# EAGLE design smart_ice_shield_pcb (EAGLE 9.6.2)
AUTHOR: Presley-Reyna-Roth; BOARD_NAME: IceyZap; DOC_NUM: 0; PROJECT_NAME: SmartIce; REVISION: 0
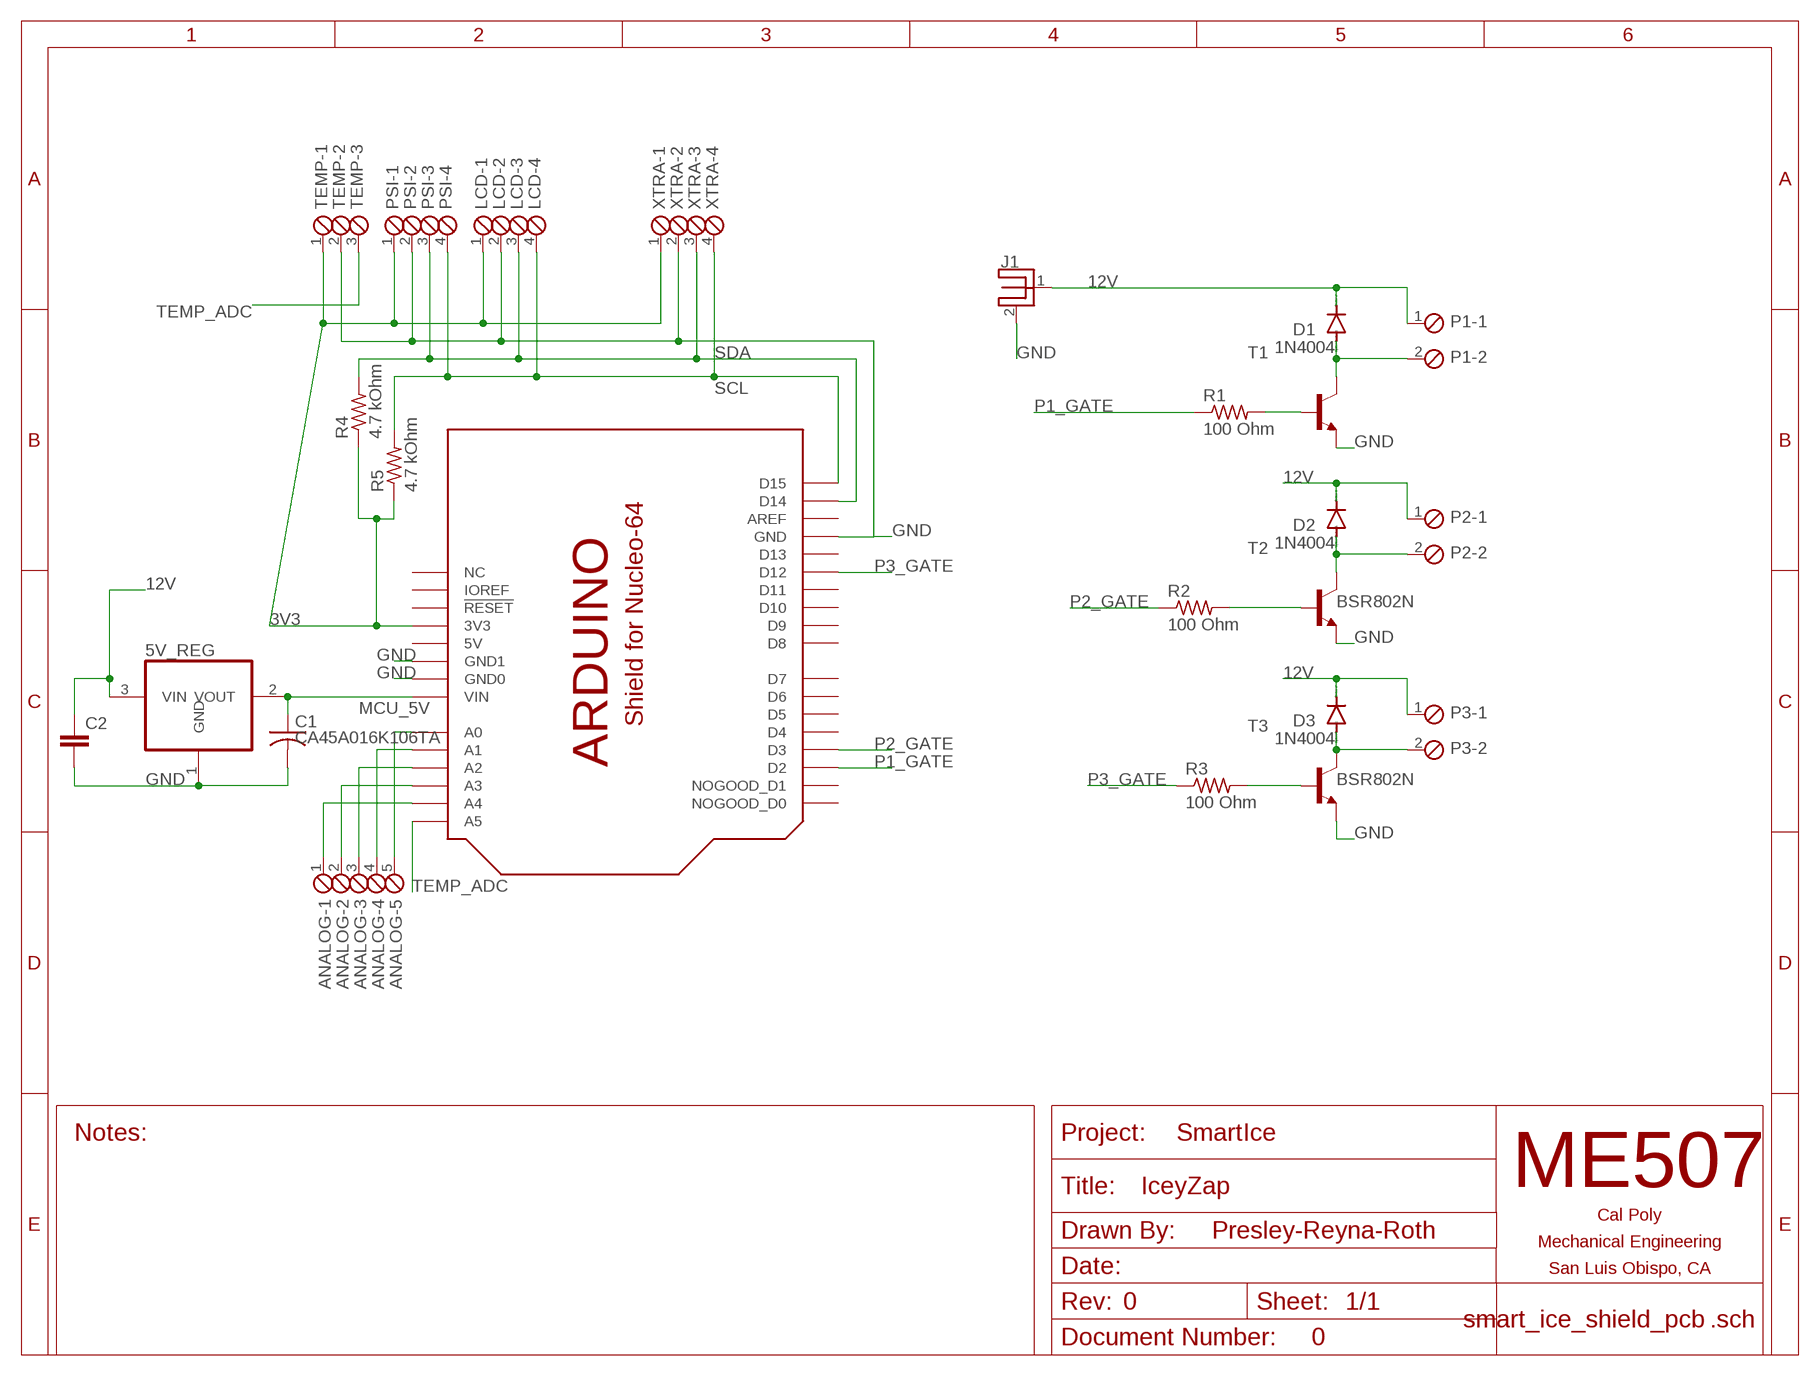
[diagram p0: schematic, sheet 1]

## Parts
5V_REG  LT1117CST  REG1117  [SOT223]
ANALOG  SCREWTERM_5P_254  [5POL254]
C1  CA45A016K106TA  C-USC1206  [C1206]
C2  C-EU025-025X050  [C025-025X050]
D1  1N4004  [DO41-10]
D2  1N4004  [DO41-10]
D3  1N4004  [DO41-10]
J1  BARREL5.5X2.1PJ-037A  [PJ-037A]
LCD  SCREWTERM_4P_254  [4POL254]
P1  SCREWTERM_2P_381  [2POL381]
P2  SCREWTERM_2P_381  [2POL381]
P3  SCREWTERM_2P_381  [2POL381]
PSI  SCREWTERM_4P_254  [4POL254]
R1  100 Ohm  R-US_R0805  [R0805]
R2  100 Ohm  R-US_R0805  [R0805]
R3  100 Ohm  R-US_R0805  [R0805]
R4  4.7 kOhm  R-US_R0805  [R0805]
R5  4.7 kOhm  R-US_R0805  [R0805]
T1  BSR802N  BSR13-NPN-SOT23-BEC  [SOT23-BEC]
T2  BSR802N  BSR13-NPN-SOT23-BEC  [SOT23-BEC]
T3  BSR802N  BSR13-NPN-SOT23-BEC  [SOT23-BEC]
TEMP  SCREWTERM_3P_254  [3POL254]
U$1  SHIELD_FOR_NUCLE0_64_SHORT  [SHIELD_FOR_NUCLEO_64_SHORT]
XTRA  SCREWTERM_4P_254  [4POL254]

## Nets
3V3: LCD.1 PSI.1 R4.1 R5.1 TEMP.1 U$1.3V(3V3) XTRA.1
12V: 5V_REG.3(VIN) C2.1 D1.C D2.C D3.C J1.1(CENTER) P1.1 P2.1 P3.1
GATE: R1.2 T1.B
GATE1: R2.2 T2.B
GATE2: R3.2 T3.B
GND: 5V_REG.1(GND) C1.2 C2.2 J1.2(BARREL) LCD.2 PSI.2 T1.E T2.E T3.E TEMP.2 U$1.GND U$1.GND1(GND0) U$1.GND2(GND1) XTRA.2
M-: D1.A P1.2 T1.C
M-1: D2.A P2.2 T2.C
M-2: D3.A P3.2 T3.C
MCU_5V: 5V_REG.2(VOUT) C1.1 U$1.VIN
N$1: ANALOG.5 U$1.A0
N$2: ANALOG.4 U$1.A1
N$3: ANALOG.3 U$1.A2
N$4: ANALOG.2 U$1.A3
N$5: ANALOG.1 U$1.A4
P1_GATE: R1.1 U$1.D2
P2_GATE: R2.1 U$1.D3
P3_GATE: R3.1 U$1.D12
SCL: LCD.4 PSI.4 R5.2 U$1.D15 XTRA.4
SDA: LCD.3 PSI.3 R4.2 U$1.D14 XTRA.3
TEMP_ADC: TEMP.3 U$1.A5
Unconnected: U$1.AREF U$1.D0(NOGOOD_D0) U$1.D1(NOGOOD_D1) U$1.D4 U$1.D5 U$1.D6 U$1.D7 U$1.D8 U$1.D9 U$1.D10 U$1.D11 U$1.D13 U$1.IOREF U$1.NC U$1.NRST(!RESET)

## Power pins joined to a net without a drawn wire
5V: U$1.5V

## Library data of the parts
5V_REG = burr-brown:REG1117: 800mA and 1A Low Dropout (LDO) Positive Regulator 1.8V, 2.5V, 2.85V, 3.3V, 5V, and Adj; MPN: REG1117; OC_FARNELL: 1097566; OC_NEWARK: 14P6981
ANALOG = ME507:SCREWTERM_5P: Screw Terminal Block This part is designed for a screw terminal connector. The 2.54mm (0.100 inch) foorprint can also be used for male or female pin headers such as those on most development boards. One can also solder wires directly into the holes, though this makes modifications or repairs to the system more inconvenient. Larger versions can carry more current.
C1 = rcl:C-US: CAPACITOR, American symbol; SPICEPREFIX: C
C2 = rcl:C-EU: CAPACITOR, European symbol; SPICEPREFIX: C
D1-D3 = diode:1N4004: DIODE general purpose rectifier, 1 A
J1 = LMLLC CONNECTORS:BARREL; MPN: PJ-037A
LCD PSI XTRA = ME507:SCREWTERM_4P: Screw Terminal Block This part is designed for a screw terminal connector. The 2.54mm (0.100 inch) foorprint can also be used for male or female pin headers such as those on most development boards. One can also solder wires directly into the holes, though this makes modifications or repairs to the system more inconvenient. Larger versions can carry more current.
P1-P3 = ME507:SCREWTERM_2P: Screw Terminal Block This part is designed for a screw terminal connector. The 2.54mm (0.100 inch) foorprint can also be used for male or female pin headers such as those on most development boards. One can also solder wires directly into the holes, though this makes modifications or repairs to the system more inconvenient. Larger versions can carry more current.
R1-R5 = rcl:R-US_: RESISTOR, American symbol; SPICEPREFIX: R
T1-T3 = transistor-neu-to92:*-NPN-: NPN Transistror
TEMP = ME507:SCREWTERM_3P: Screw Terminal Block This part is designed for a screw terminal connector. The 2.54mm (0.100 inch) foorprint can also be used for male or female pin headers such as those on most development boards. One can also solder wires directly into the holes, though this makes modifications or repairs to the system more inconvenient. Larger versions can carry more current.
U$1 = ME507:SHIELD_FOR_NUCLE0_64: Arduino Style Shield for Nucleo-64 This is a board outline with pin locations for an Arduino style shield which fits on top of an STM32 Nucleo-64. Pin names are generic except for Nucleo specific pins such as IOREF. There are two board sizes, the standard which matches the size of an Arduino Uno, and the short version which can be less expensive to produce if you don't need a lot of board area. The outline is on the DIMENSION layer. When making a new board, you must delete the lines which form the default board outline so that this package's outlines control the dimensions of the board. Pins D0 and D1 are connected to a communications port and are not available for general use, so they are labeled as NOGOOD on the symbol and footprints.

## Board
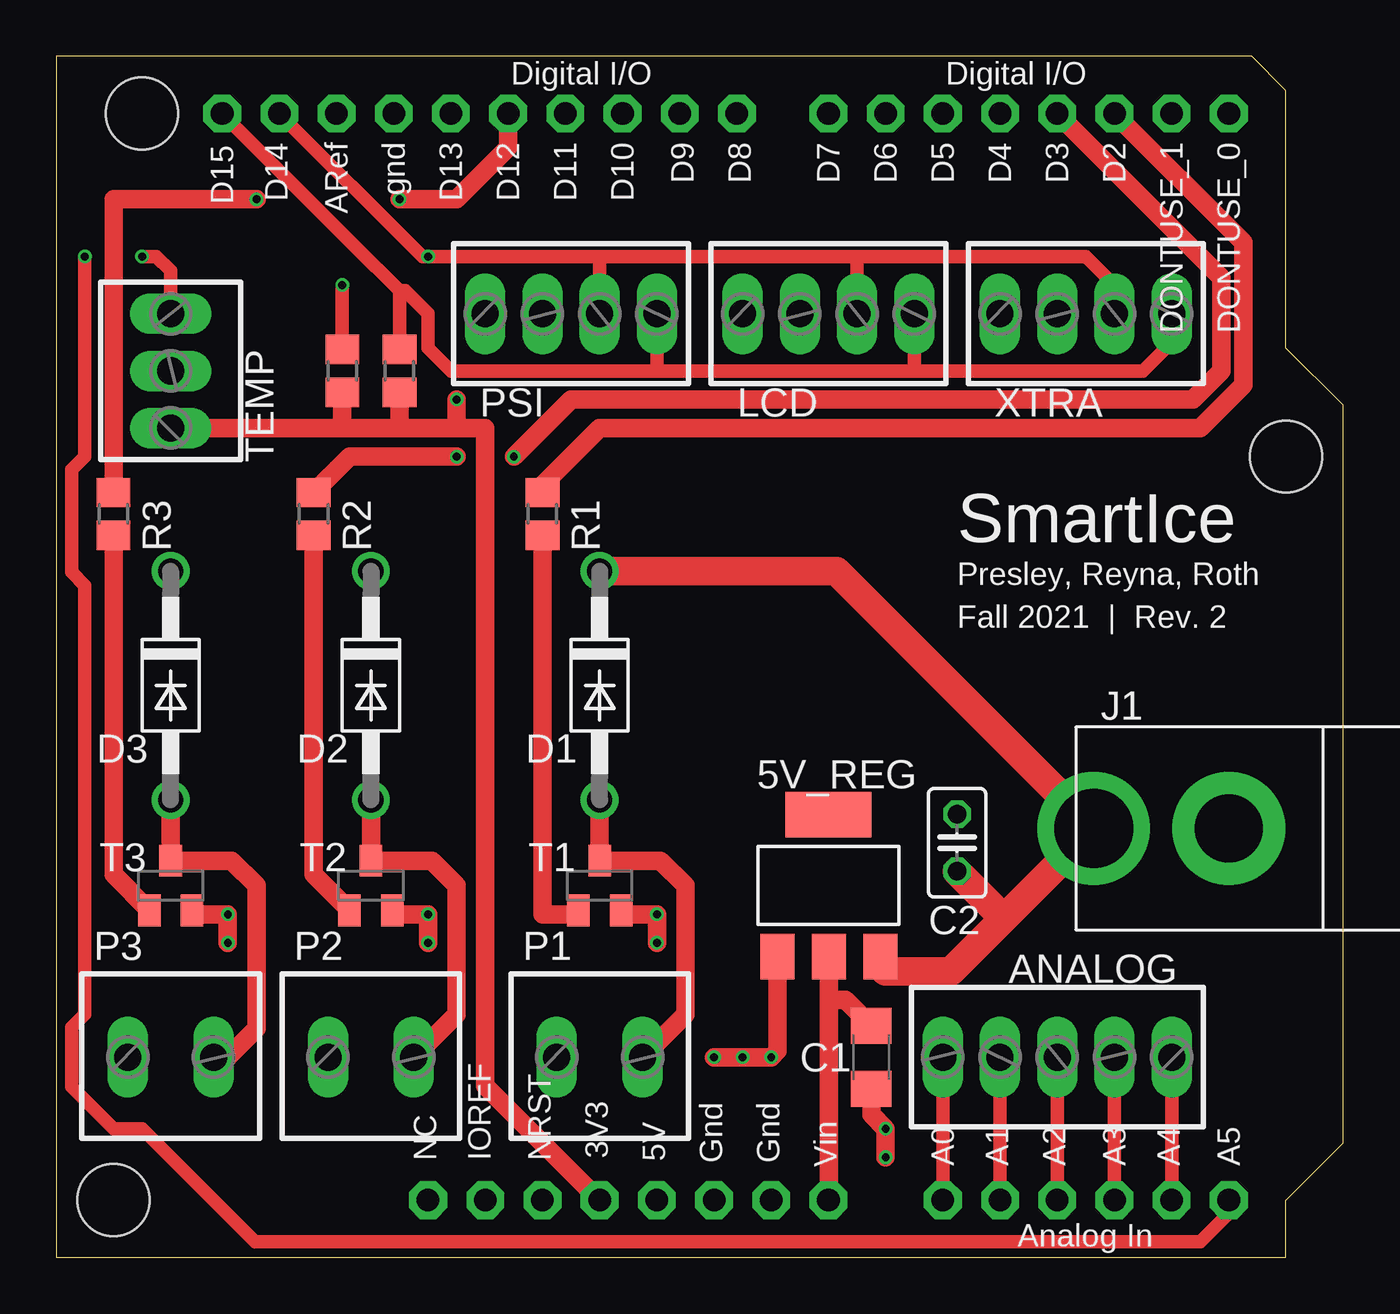
[diagram p1: board, top side]
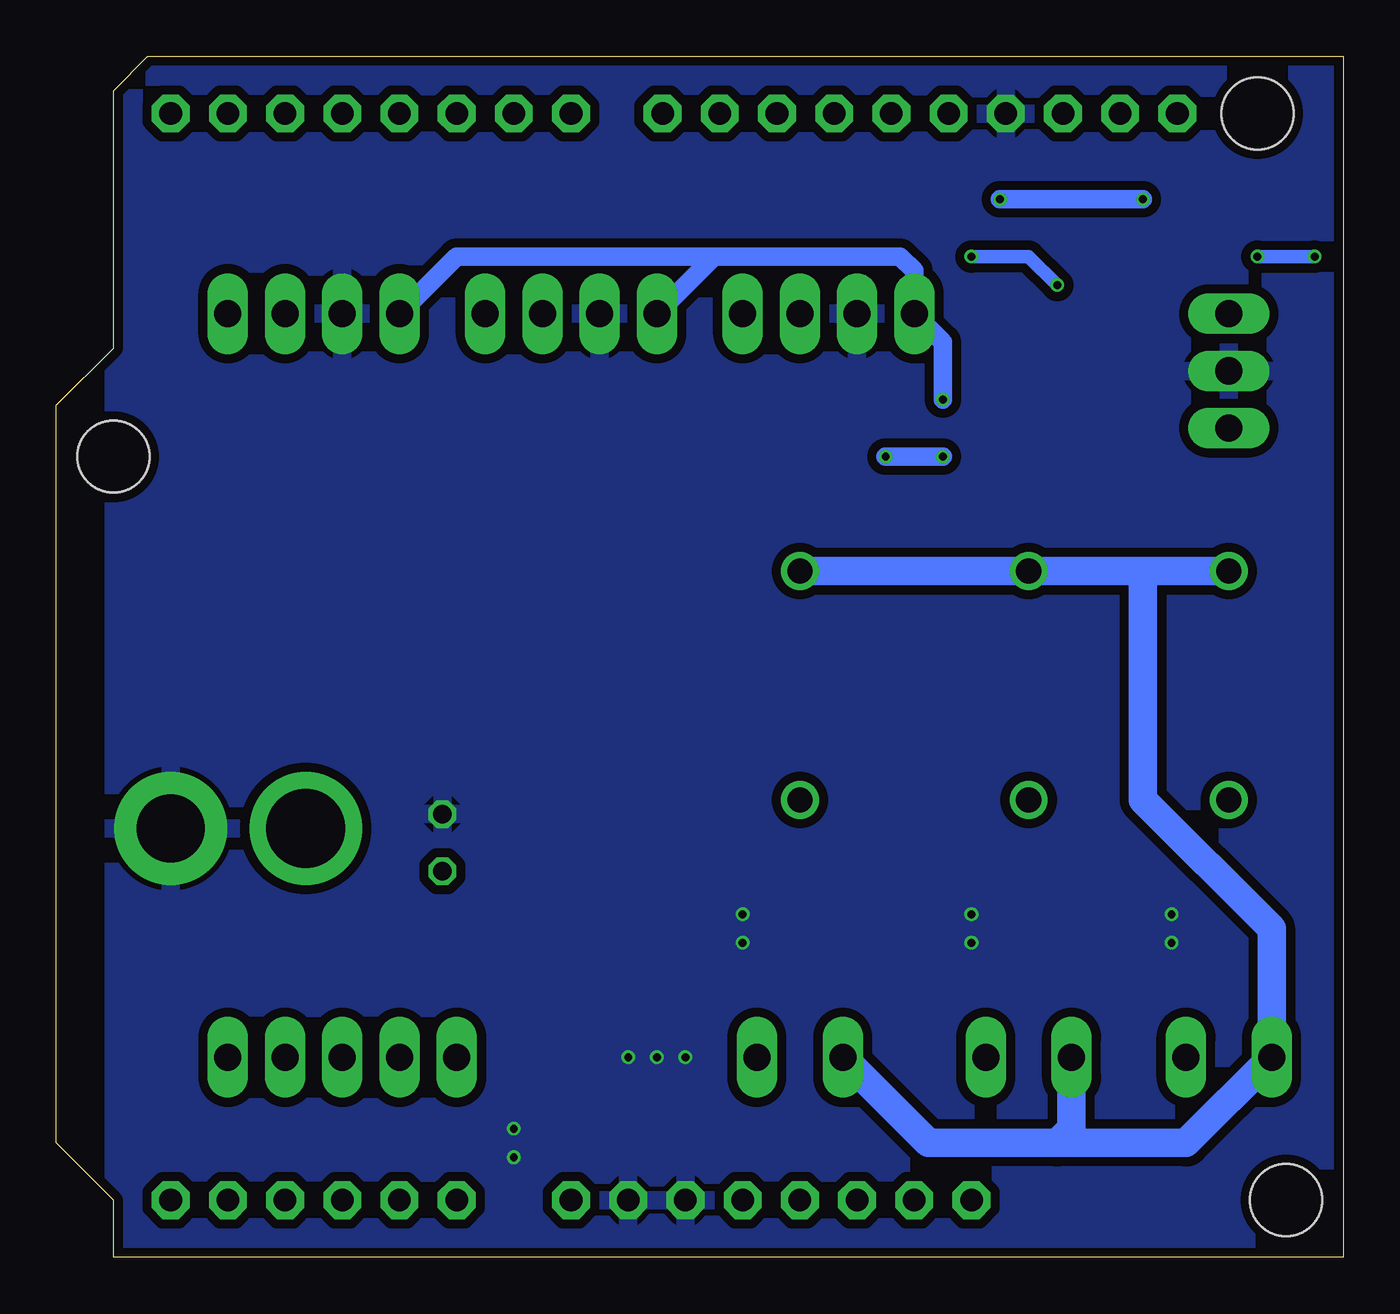
[diagram p2: board, bottom side, seen from below]

Size 57.15 x 53.34 mm. Coordinates in mm from the lower left corner, seen from the top.
Copper layers (1*16): Top 0.035559375mm / dielectric 1.6mm / Bottom 0.035559375mm
Design rules "oshpark-2layer": minimum track width 6mil, minimum drill 10mil, track to track 6mil, track to pad 6mil, pad to pad 6mil, via to via 6mil, smd to smd 6mil, copper to edge 15mil, drill to drill 6mil, minimum pad ring 5mil, minimum via ring 5mil, stop-mask expansion 2.5mil, vias tented up to drill 0mil, thermal gap 10mil

### Footprints (pad centres in the part's own frame; a part is rotated, then mirrored left to right if it is on the bottom)
SOT223 = smd 1.499 x 2.007: 1 -2.261,-3.15; 2 0.025,-3.15; 3 2.311,-3.15 | smd 3.81 x 2.007: 4 0,3.15
5POL254 = drill 1.2 long: 1 -5.08,0; 2 -2.54,0; 3 0,0; 4 2.54,0; 5 5.08,0
C1206 = smd 1.6 x 1.8: 1 -1.4,0; 2 1.4,0
C025-025X050 = drill 0.813 octagon: 1 -1.27,0; 2 1.27,0
DO41-10 = drill 1.118: A 5.08,0; C -5.08,0
PJ-037A = drill 3.5 pad 5: 1 6,0 | drill 3 pad 5: 2 0,0
4POL254 = drill 1.2 long: 1 -3.81,0; 2 -1.27,0; 3 1.27,0; 4 3.81,0
2POL381 = drill 1.2 long: 1 -1.905,0; 2 1.905,0
R0805 = smd 1.3 x 1.5: 1 -0.95,0; 2 0.95,0
SOT23-BEC = smd 1 x 1.4: B -0.95,-1.1; C 0,1.1; E 0.95,-1.1
3POL254 = drill 1.2 long: 1 -2.54,0; 2 0,0; 3 2.54,0
SHIELD_FOR_NUCLEO_64_SHORT = drill 1 pad 1.676 octagon: 3V 35.56,2.54; 5V 38.1,2.54; A0 50.8,2.54; A1 53.34,2.54; A2 55.88,2.54; A3 58.42,2.54; A4 60.96,2.54; A5 63.5,2.54; AREF 23.876,50.8; D0 63.5,50.8; D1 60.96,50.8; D2 58.42,50.8; D3 55.88,50.8; D4 53.34,50.8; D5 50.8,50.8; D6 48.26,50.8; D7 45.72,50.8; D8 41.656,50.8; D9 39.116,50.8; D10 36.576,50.8; D11 34.036,50.8; D12 31.496,50.8; D13 28.956,50.8; D14 21.336,50.8; D15 18.796,50.8; GND 26.416,50.8; GND1 43.18,2.54; GND2 40.64,2.54; IOREF 30.48,2.54; NC 27.94,2.54; NRST 33.02,2.54; VIN 45.72,2.54 | hole 3.2: 15.24,50.8; 66.04,35.56; 13.97,2.54

### Placement (x,y rotation side)
5V_REG  34.29,16.51 0 top
ANALOG  44.45,8.89 180 top
C1  36.2,8.89 270 top
C2  40,18.41 90 top
D1  24.13,25.4 270 top
D2  13.97,25.4 270 top
D3  5.08,25.4 270 top
J1  52.07,19.05 180 top
LCD  34.29,41.91 0 top
P1  24.13,8.89 0 top
P2  13.97,8.89 0 top
P3  5.08,8.89 0 top
PSI  22.86,41.91 0 top
R1  21.59,33.02 270 top
R2  11.43,33.02 270 top
R3  2.54,33.02 270 top
R4  12.7,39.37 90 top
R5  15.24,39.37 90 top
T1  24.13,16.51 0 top
T2  13.97,16.51 0 top
T3  5.08,16.51 0 top
TEMP  5.08,39.37 90 top
U$1  -11.43,0 0 top
XTRA  45.72,41.91 0 top

### Tracks (layer width: path | path; a pad name or v marks a point on that pad's centre or on a via)
3V3  (via drill 0.35)
  Top 0.813: U$1.3V 19.05,7.62 19.05,36.83 17.78,36.83 | 17.78,36.83 15.24,36.83 | 15.24,36.83 12.7,36.83 | R4.1 12.7,36.83 | R5.1 15.24,36.83 | 17.78,36.83 v17.78,38.1 | 12.7,36.83 TEMP.1
  Bottom 0.813: v17.78,38.1 17.78,40.64 PSI.1 19.05,43.81 19.68,44.45 27.94,44.45 | LCD.1 27.94,44.45 | 27.94,44.45 39.37,44.45 XTRA.1
12V
  Top 1.27: 42.08,15.07 J1.1 34.64,30.48 D1.C | 42.08,15.07 39.72,12.7 36.83,12.7 36.6,12.93 5V_REG.3 | 42.08,15.07 C2.1
  Bottom 1.27: D1.C D2.C 8.89,30.48 | 8.89,30.48 D3.C | 8.89,30.48 8.89,20.32 3.18,14.61 P3.1 6.99,5.08 12.7,5.08 | P1.1 18.41,5.08 12.7,5.08 | 12.7,5.08 12.07,5.71 P2.1
GATE
  Top 0.813: T1.B 23.01,15.24 21.59,15.24 R1.2
GATE1
  Top 0.813: T2.B 11.43,17 R2.2
GATE2
  Top 0.813: T3.B 2.54,17 R3.2
GND  (via drill 0.35)
  Top 0.813: 5V_REG.1 32.03,9.17 v31.75,8.89 v30.48,8.89 v29.21,8.89 | T2.E 15.09,15.24 v16.51,15.24 v16.51,13.97 | T3.E 6.2,15.24 v7.62,15.24 v7.62,13.97 | T1.E 25.25,15.24 v26.67,15.24 v26.67,13.97 | C1.2 36.2,6.35 v36.83,5.71 v36.83,4.45
  pour Bottom (isolate 0.406): 0,53.34 0,0 54.61,0 54.61,52.07 53.34,53.34
M-
  Top 0.813: D1.A T1.C 26.84,17.61 27.94,16.51 27.94,10.79 P1.2
M-1
  Top 0.813: D2.A T2.C 16.68,17.61 17.78,16.51 17.78,10.79 P2.2
M-2
  Top 0.813: D3.A T3.C 7.79,17.61 8.89,16.51 8.89,10.16 7.62,8.89 P3.2
MCU_5V
  Top 0.813: U$1.VIN 34.31,2.56 34.31,11.43 | 5V_REG.2 34.31,11.43 | 34.31,11.43 35.06,11.43 C1.1
N$1
  Top 0.61: U$1.A0 ANALOG.5
N$2
  Top 0.61: U$1.A1 ANALOG.4
N$3
  Top 0.61: U$1.A2 ANALOG.3
N$4
  Top 0.61: U$1.A3 ANALOG.2
N$5
  Top 0.61: U$1.A4 ANALOG.1
P1_GATE
  Top 0.813: R1.1 21.59,34.29 24.13,36.83 50.8,36.83 52.7,38.73 52.7,45.08 U$1.D2
P2_GATE  (via drill 0.35)
  Top 0.813: R2.1 13.02,35.56 v17.78,35.56 | v20.32,35.56 22.86,38.1 50.47,38.1 51.74,39.37 51.74,43.51 U$1.D3
  Bottom 0.813: v17.78,35.56 v20.32,35.56
P3_GATE  (via drill 0.35)
  Top 0.813: R3.1 2.54,46.99 v8.89,46.99 | v15.24,46.99 17.78,46.99 20.07,49.28 U$1.D12
  Bottom 0.813: v8.89,46.99 v15.24,46.99
SCL
  Top 0.61: U$1.D15 13.21,44.96 15.24,42.93 | R5.2 15.24,42.93 | 15.24,42.93 15.49,42.93 16.51,41.91 16.51,40.39 17.53,39.37 26.67,39.37 | XTRA.4 49.53,40.64 48.26,39.37 38.1,39.37 | 26.67,39.37 38.1,39.37 | 26.67,39.37 PSI.4 | 38.1,39.37 LCD.4
SDA  (via drill 0.35)
  Top 0.61: U$1.D14 16.26,44.45 v16.51,44.45 24.13,44.45 | 35.56,44.45 24.13,44.45 | R4.2 12.7,41.91 v12.7,43.18 | 24.13,44.45 PSI.3 | 35.56,44.45 LCD.3 | XTRA.3 46.99,43.18 45.72,44.45 35.56,44.45
  Bottom 0.61: v12.7,43.18 13.97,44.45 v16.51,44.45
TEMP_ADC  (via drill 0.35)
  Top 0.61: TEMP.3 5.08,43.81 4.45,44.45 v3.81,44.45 | v1.27,44.45 1.27,35.56 0.69,34.98 0.69,30.43 1.27,29.84 1.27,10.79 0.69,10.21 0.69,7.57 2.54,5.71 3.81,5.71 8.84,0.69 50.8,0.69 52.07,1.96 U$1.A5
  Bottom 0.61: v3.81,44.45 v1.27,44.45

### Text on the board
tPlace: SmartIce | Presley, Reyna, Roth | Fall 2021 | Rev. 2